# Altium schematic sheet ROCKCHIP_PWR_SUPPLY.SchDoc
size A4; SheetNumber: 6; SheetTotal: 27
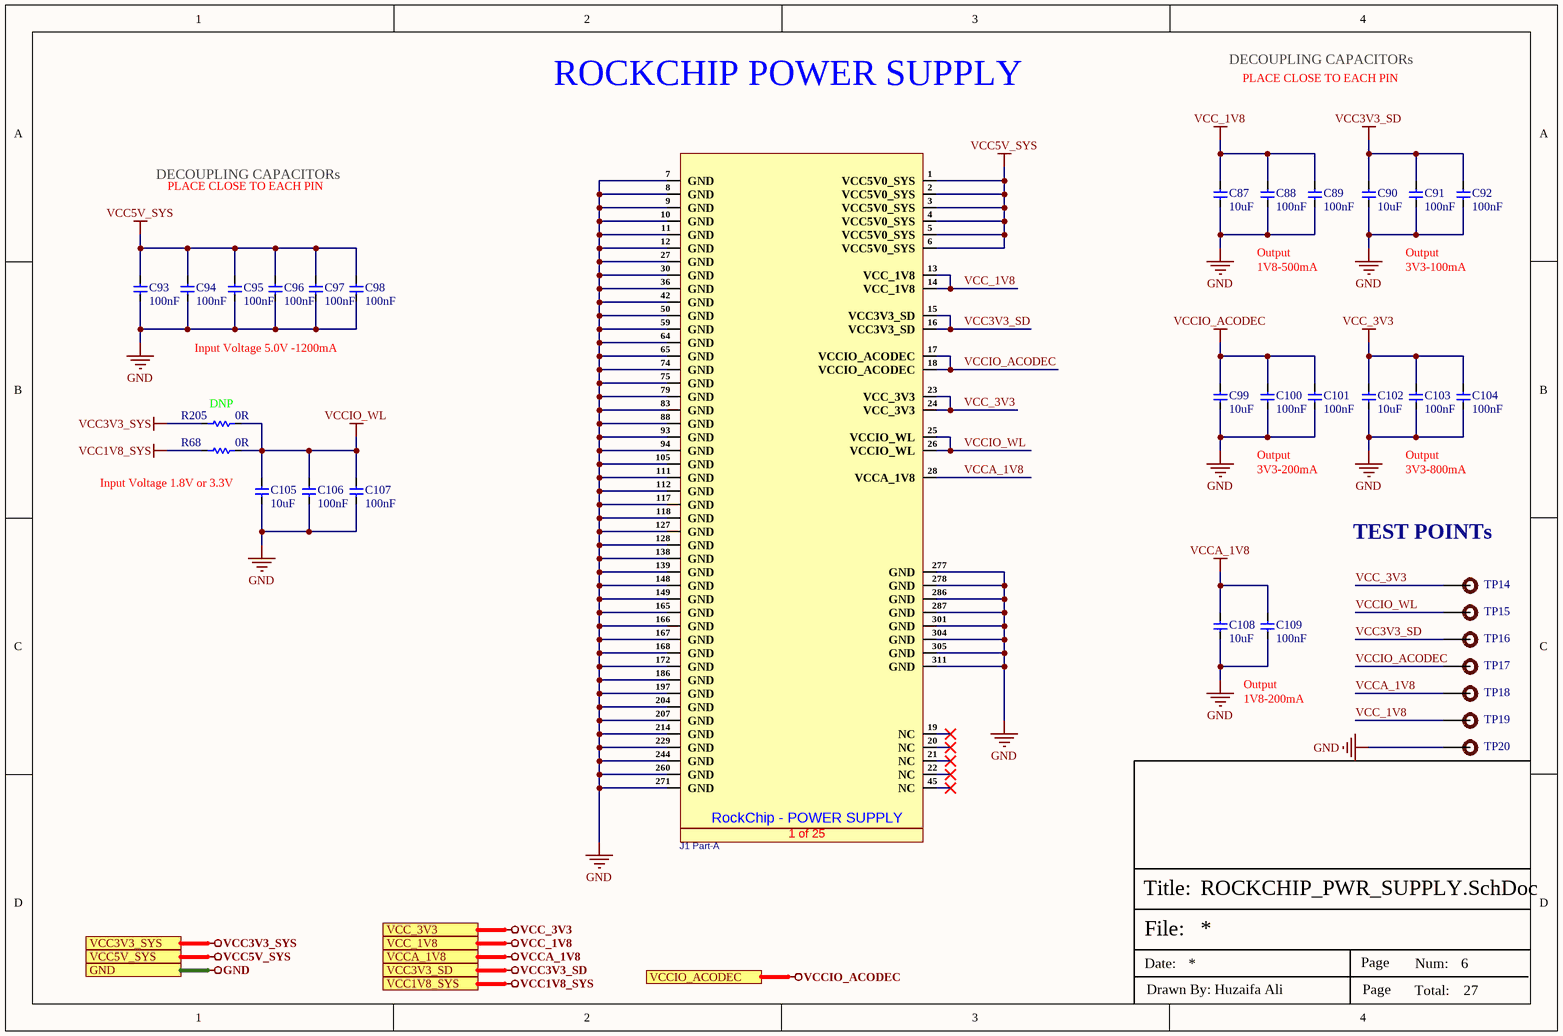
[diagram p0: ROCKCHIP_PWR_SUPPLY.SchDoc]

## Parts
C87  10uF  [Cap-0603]
C88  100nF  [Cap-0402]
C89  100nF  [Cap-0402]
C90  10uF  [Cap-0603]
C91  100nF  [Cap-0402]
C92  100nF  [Cap-0402]
C93  100nF  [Cap-0402]
C94  100nF  [Cap-0402]
C95  100nF  [Cap-0402]
C96  100nF  [Cap-0402]
C97  100nF  [Cap-0402]
C98  100nF  [Cap-0402]
C99  10uF  [Cap-0603]
C100  100nF  [Cap-0402]
C101  100nF  [Cap-0402]
C102  10uF  [Cap-0603]
C103  100nF  [Cap-0402]
C104  100nF  [Cap-0402]
C105  10uF  [Cap-0603]
C106  100nF  [Cap-0402]
C107  100nF  [Cap-0402]
C108  10uF  [Cap-0603]
C109  100nF  [Cap-0402]
J1_Part-  AS0B826-S78B-7H  [AS0B826-S78B-7H]  (value not drawn)  (part A of 25)
R68  0R  [Res-0402]
R205  DNP  [Res-0402]
TP14  TEST POINT 0.5mm Dia  [Test-point - 0.5mm]  (value not drawn)  (no BOM)
TP15  TEST POINT 0.5mm Dia  [Test-point - 0.5mm]  (value not drawn)  (no BOM)
TP16  TEST POINT 0.5mm Dia  [Test-point - 0.5mm]  (value not drawn)  (no BOM)
TP17  TEST POINT 0.5mm Dia  [Test-point - 0.5mm]  (value not drawn)  (no BOM)
TP18  TEST POINT 0.5mm Dia  [Test-point - 0.5mm]  (value not drawn)  (no BOM)
TP19  TEST POINT 0.5mm Dia  [Test-point - 0.5mm]  (value not drawn)  (no BOM)
TP20  TEST POINT 0.5mm Dia  [Test-point - 0.5mm]  (value not drawn)  (no BOM)

## Ports
GND (see TOP SHEET[4B], AUDIO_INTERFACE[1D], BUCK REGULATOR[3D], DEBUG_UART_INTERFACE[3D], DIGITAL IO_RELAY_SHEET[5D], DUAL_SIM_INTERFACE[3D], ETHERNET_PHY0[4D], ETHERNET_PHY1[4D], GSM_INTERFACE[2D], HDMI_INTERFACE[3D], INPUT_PROTECTION[3D], LINEAR_VOLTAGE_REG[3D], MICRO_SD_INTERFACE[3D], MIPI-DSI DISPLAY[3D], POWER SECTION[3D], PUSH BUTTONs_INTERFACE[3C], RGB_LEDs_INTERFACE[3D], ROCKCHIP_SYSTEM_CONTROL[3C], RS232_RS485_INTERFACE[3C], SENSOR_SHEET[3D], USB2.0_INTERFACE[3D], USB3.0_INTERFACE[3D], USB-C_INTERFACE[2D], WIEGAND_INTERFACE[3D], WIFI_BLUETOOTH_SHEET[4C]), VCC1V8_SYS (see TOP SHEET[3A], ETHERNET_PHY0[4D], ETHERNET_PHY1[4D], LINEAR_VOLTAGE_REG[3D], POWER SECTION[3D], WIFI_BLUETOOTH_SHEET[4C]), VCC3V3_SD (see TOP SHEET[4A], MICRO_SD_INTERFACE[3D]), VCC3V3_SYS (see TOP SHEET[3A], AUDIO_INTERFACE[1D], BUCK REGULATOR[3D], DEBUG_UART_INTERFACE[3D], DIGITAL IO_RELAY_SHEET[5D], ETHERNET_PHY0[4D], ETHERNET_PHY1[4D], GSM_INTERFACE[2D], HDMI_INTERFACE[3D], LINEAR_VOLTAGE_REG[3D], MIPI-DSI DISPLAY[3D], POWER SECTION[3D], PUSH BUTTONs_INTERFACE[3C], ROCKCHIP_SYSTEM_CONTROL[3C], RS232_RS485_INTERFACE[3C], SENSOR_SHEET[3D], USB-C_INTERFACE[2D], WIEGAND_INTERFACE[3D], WIFI_BLUETOOTH_SHEET[4C]), VCC5V_SYS (see TOP SHEET[3A], BUCK REGULATOR[3D], DIGITAL IO_RELAY_SHEET[5D], HDMI_INTERFACE[3D], LINEAR_VOLTAGE_REG[3D], MIPI-DSI DISPLAY[3D], POWER SECTION[3D], RGB_LEDs_INTERFACE[3D], USB2.0_INTERFACE[3D], USB3.0_INTERFACE[3D], USB-C_INTERFACE[2D], WIEGAND_INTERFACE[3D]), VCC_1V8 (see TOP SHEET[4A]), VCC_3V3 (see TOP SHEET[4A]), VCCA_1V8 (see TOP SHEET[4A], PUSH BUTTONs_INTERFACE[3C], ROCKCHIP_SYSTEM_CONTROL[3C]), VCCIO_ACODEC (see TOP SHEET[4A], AUDIO_INTERFACE[1D])

## Nets
GND: C87.1 C88.1 C89.1 C90.1 C91.1 C92.1 C93.1 C94.1 C95.1 C96.1 C97.1 C98.1 C99.1 C100.1 C101.1 C102.1 C103.1 C104.1 C105.1 C106.1 C107.1 C108.1 C109.1 J1_Part-.7(GND) J1_Part-.8(GND) J1_Part-.9(GND) J1_Part-.10(GND) J1_Part-.11(GND) J1_Part-.12(GND) J1_Part-.27(GND) J1_Part-.30(GND) J1_Part-.36(GND) J1_Part-.42(GND) J1_Part-.50(GND) J1_Part-.59(GND) J1_Part-.64(GND) J1_Part-.65(GND) J1_Part-.74(GND) J1_Part-.75(GND) J1_Part-.79(GND) J1_Part-.83(GND) J1_Part-.88(GND) J1_Part-.93(GND) J1_Part-.94(GND) J1_Part-.105(GND) J1_Part-.111(GND) J1_Part-.112(GND) J1_Part-.117(GND) J1_Part-.118(GND) J1_Part-.127(GND) J1_Part-.128(GND) J1_Part-.138(GND) J1_Part-.139(GND) J1_Part-.148(GND) J1_Part-.149(GND) J1_Part-.165(GND) J1_Part-.166(GND) J1_Part-.167(GND) J1_Part-.168(GND) J1_Part-.172(GND) J1_Part-.186(GND) J1_Part-.197(GND) J1_Part-.204(GND) J1_Part-.207(GND) J1_Part-.214(GND) J1_Part-.229(GND) J1_Part-.244(GND) J1_Part-.260(GND) J1_Part-.271(GND) J1_Part-.277(GND) J1_Part-.278(GND) J1_Part-.286(GND) J1_Part-.287(GND) J1_Part-.301(GND) J1_Part-.304(GND) J1_Part-.305(GND) J1_Part-.311(GND) TP20.1 ; port GND
VCC1V8_SYS: R68.1 ; port VCC1V8_SYS
VCC3V3_SD: C90.2 C91.2 C92.2 J1_Part-.15(VCC3V3_SD) J1_Part-.16(VCC3V3_SD) TP16.1 ; port VCC3V3_SD
VCC3V3_SYS: R205.1 ; port VCC3V3_SYS
VCC5V_SYS: C93.2 C94.2 C95.2 C96.2 C97.2 C98.2 J1_Part-.1(VCC5V0_SYS) J1_Part-.2(VCC5V0_SYS) J1_Part-.3(VCC5V0_SYS) J1_Part-.4(VCC5V0_SYS) J1_Part-.5(VCC5V0_SYS) J1_Part-.6(VCC5V0_SYS) ; port VCC5V_SYS
VCC_1V8: C87.2 C88.2 C89.2 J1_Part-.13(VCC_1V8) J1_Part-.14(VCC_1V8) TP19.1 ; port VCC_1V8
VCC_3V3: C102.2 C103.2 C104.2 J1_Part-.23(VCC_3V3) J1_Part-.24(VCC_3V3) TP14.1 ; port VCC_3V3
VCCA_1V8: C108.2 C109.2 J1_Part-.28(VCCA_1V8) TP18.1 ; port VCCA_1V8
VCCIO_ACODEC: C99.2 C100.2 C101.2 J1_Part-.17(VCCIO_ACODEC) J1_Part-.18(VCCIO_ACODEC) TP17.1 ; port VCCIO_ACODEC
VCCIO_WL: C105.2 C106.2 C107.2 J1_Part-.25(VCCIO_WL) J1_Part-.26(VCCIO_WL) R68.2 R205.2 TP15.1

Not connected (* = marked no-connect by the designer): J1_Part- 19(NC)* 20(NC)* 21(NC)* 22(NC)* 45(NC)*

## Notes on the sheet
- ROCKCHIP POWER SUPPLY
- PLACE CLOSE TO EACH PIN
- DECOUPLING CAPACITORs
- 1V8-500mA
- Output
- 3V3-100mA
- Input Voltage 5.0V -1200mA
- (near R205) 0R
- (near C105) Input Voltage 1.8V or 3.3V
- 3V3-200mA
- 3V3-800mA
- (near TP14) TEST POINTs
- 1V8-200mA
- File:
- Title:
- Date:
- Page
- Num:
- Total:
- Drawn By: Huzaifa Ali
- (in symbol AS0B826-S78B-7H, part A) RockChip - POWER SUPPLY; 1 of 25

## Library data of the parts
C87 C90 C99 C102 C105 C108 = C1608X5R1E106M080AC: CAP CER 10UF 25V X5R 0603; Manufacturer: TDK; Tolerance: 20%; Dielectric Material: Ceramic; Item Type: Capacitor; Manufacturer Part Number: C1608X5R1E106M080AC; Supplier 1: Digi-Key; Stock 1: 61681; Pricing 1: 1=0.96, 10=0.704, 100=0.483, 500=0.38238, 1000=0.322 (USD); Mount: Surface Mount; Case/Package: 0603; Case Code (Metric): 1608; Case Code (Imperial): 0603; Min Operating Temperature: -55°C; Max Operating Temperature: 85°C; Capacitance: 10uF; Dielectric: X5R; Packaging: Tape and Reel; Voltage Rating: 25V; Package Quantity: 1; Voltage Rating (DC): 25V; Termination: SMD/SMT; Length: 1.6mm; Width: 0.8mm; Height: 0.8mm; Thickness: 0.039inch; Depth: 0.8mm; REACH SVHC: No SVHC; Lead Free: Lead Free; Supplier Part Number 1: 445-9015-1-ND; LCSC Part Number: C2168289; Weight: 7.1E-05oz; Composition: Ceramic
C88 C89 C91-C98 C100 C101 C103 C104 C106 C107 C109 = CC0402KRX5R7BB104: CAP CER 0.1UF 16V X5R 0402; Manufacturer: Yageo; Tolerance: 10%; Manufacturer Part Number: CC0402KRX5R7BB104; RoHS: Yes; Category: Ceramic Capacitors; Supplier 1: Mouser; Stock 1: 936792; Pricing 1: 1=0.10000, 10=0.02300, 50=0.02300, 100=0.01100, 1000=0.00600, 10000=0.00400 (USD); Mount: Surface Mount; Case/Package: 0402; Number of Pins: 2; Case Code (Metric): 1005; Case Code (Imperial): 0402; Min Operating Temperature: -55°C; Max Operating Temperature: 85°C; Capacitance: 100nF; Dielectric: X5R; Packaging: Tape and Reel; Voltage Rating: 16V; Package Quantity: 1; Voltage Rating (DC): 16V; Termination: SMD/SMT; Resistor Type: Ceramic; Series: CC; Construction: Flat; Length: 1mm; Width: 0.02inch; Height: 0.5mm; Thickness: 0.022inch; Depth: 0.5mm; Radiation Hardening: No; REACH SVHC: Unknown; Lead Free: Lead Free; Halogen Free: Halogen Free; RoHS Compliant: Yes; ComponentLink1URL: https://datasheet.ciiva.com/155/mlccorderingcode-155879.pdf?src-supplier=Digi-Key; ComponentLink1Description: https://datasheet.ciiva.com/155/mlccorderingcode-155879.pdf?src-supplier=Digi-Key; ComponentLink2URL: https://datasheet.ciiva.com/155/mlccorderingcode-155878.pdf?src-supplier=Digi-Key; ComponentLink2Description: https://datasheet.ciiva.com/155/mlccorderingcode-155878.pdf?src-supplier=Digi-Key; ComponentLink3URL: https://datasheet.ciiva.com/155/mlccorderingcode-155880.pdf?src-supplier=Digi-Key; ComponentLink3Description: https://datasheet.ciiva.com/155/mlccorderingcode-155880.pdf?src-supplier=Digi-Key; ComponentLink4URL: https://datasheet.ciiva.com/11464/upy-gphc-x5r-4v-to-50v-12-11464869.pdf?src-supplier=Avnet; ComponentLink4Description: https://datasheet.ciiva.com/11464/upy-gphc-x5r-4v-to-50v-12-11464869.pdf?src-supplier=Avnet; Supplier Part Number 1: 603-CC402KRX5R7BB104; LCSC Part Number: C106204
J1_Part- = AS0B826-S78B-7H: SMD,P=0.5mm,Surface Mount，Right Angle; Manufacturer: FOXCONN; Item Type: Card Edge Connectors; Supplier: LCSC; LCSC Part Number: C426232; Manufacturer Part Number: AS0B826-S78B-7H; RoHS: No; Stock: 4979; Pricing: 1=9.21, 10=8.287, 25=7.8064, 50=7.6064, 100=7.4062 (USD)
R68 = RC0402FR-070RL: RES 0 OHM JUMPER 1/16W 0402; Manufacturer: Yageo; Tolerance: 1%; Power Rating: 62.5mW; Voltage Rating: 50V; Temperature Coefficient: 200ppm/°C; Max Power Dissipation: 63mW; Supplier 1: Mouser; Manufacturer Part Number: RC0402FR-070RL; RoHS: Yes; Category: Chip SMD Resistors; Stock 1: 8556842; Pricing 1: 1=0.10000, 10=0.01400, 50=0.01400, 100=0.00600, 1000=0.00300, 5000=0.00200, 10000=0.00100 (USD); Mount: Surface Mount; Case/Package: 0402; Contact Plating: Tin,Matte; Case Code (Imperial): 0402; Case Code (Metric): 1005; Size Code: 0402; Min Operating Temperature: -55°C; Max Operating Temperature: 155°C; Resistance: 0R; Resistor Type: Thick Film; Packaging: Tape and Reel; Termination: SMD/SMT; Features: Moisture Resistant; Series: RC; Number of Terminations: 2; Length: 1mm; Width: 0.5mm; Height: 0.35mm; Radiation Hardening: No; Lead Free: Lead Free; RoHS Compliant: Yes; ComponentLink1URL: https://datasheet.ciiva.com/8896/pyu-rc0402-51-rohs-l-6-8896149.pdf?src-supplier=Avnet; ComponentLink1Description: https://datasheet.ciiva.com/8896/pyu-rc0402-51-rohs-l-6-8896149.pdf?src-supplier=Avnet; ComponentLink2URL: https://datasheet.ciiva.com/16790/pyu-rc0402-51-rohs-l-6-r-16790444.pdf?src-supplier=Future+Electronics; ComponentLink2Description: https://datasheet.ciiva.com/16790/pyu-rc0402-51-rohs-l-6-r-16790444.pdf?src-supplier=Future+Electronics; Supplier Part Number 1: 603-RC0402FR-070RL; LCSC Part Number: C106231
R205 = RC0402FR-070RL: RES 0 OHM JUMPER 1/16W 0402; Manufacturer: Yageo; Resistance: 0R; Tolerance: 1%; Power Rating: 62.5mW; Voltage Rating: 50V; Temperature Coefficient: 200ppm/°C; Max Power Dissipation: 63mW; Supplier 1: Mouser; Manufacturer Part Number: RC0402FR-070RL; RoHS: Yes; Category: Chip SMD Resistors; Stock 1: 8556842; Pricing 1: 1=0.10000, 10=0.01400, 50=0.01400, 100=0.00600, 1000=0.00300, 5000=0.00200, 10000=0.00100 (USD); Mount: Surface Mount; Case/Package: 0402; Contact Plating: Tin,Matte; Case Code (Imperial): 0402; Case Code (Metric): 1005; Size Code: 0402; Min Operating Temperature: -55°C; Max Operating Temperature: 155°C; Resistor Type: Thick Film; Packaging: Tape and Reel; Termination: SMD/SMT; Features: Moisture Resistant; Series: RC; Number of Terminations: 2; Length: 1mm; Width: 0.5mm; Height: 0.35mm; Radiation Hardening: No; Lead Free: Lead Free; RoHS Compliant: Yes; ComponentLink1URL: https://datasheet.ciiva.com/8896/pyu-rc0402-51-rohs-l-6-8896149.pdf?src-supplier=Avnet; ComponentLink1Description: https://datasheet.ciiva.com/8896/pyu-rc0402-51-rohs-l-6-8896149.pdf?src-supplier=Avnet; ComponentLink2URL: https://datasheet.ciiva.com/16790/pyu-rc0402-51-rohs-l-6-r-16790444.pdf?src-supplier=Future+Electronics; ComponentLink2Description: https://datasheet.ciiva.com/16790/pyu-rc0402-51-rohs-l-6-r-16790444.pdf?src-supplier=Future+Electronics; Supplier Part Number 1: 603-RC0402FR-070RL; LCSC Part Number: C106231
TP14-TP20 = TEST POINT 0.5mm Dia: Test Point ON; Item Type: Test Point; Manufacturer Part Number: TEST POINT 0.5mm Dia